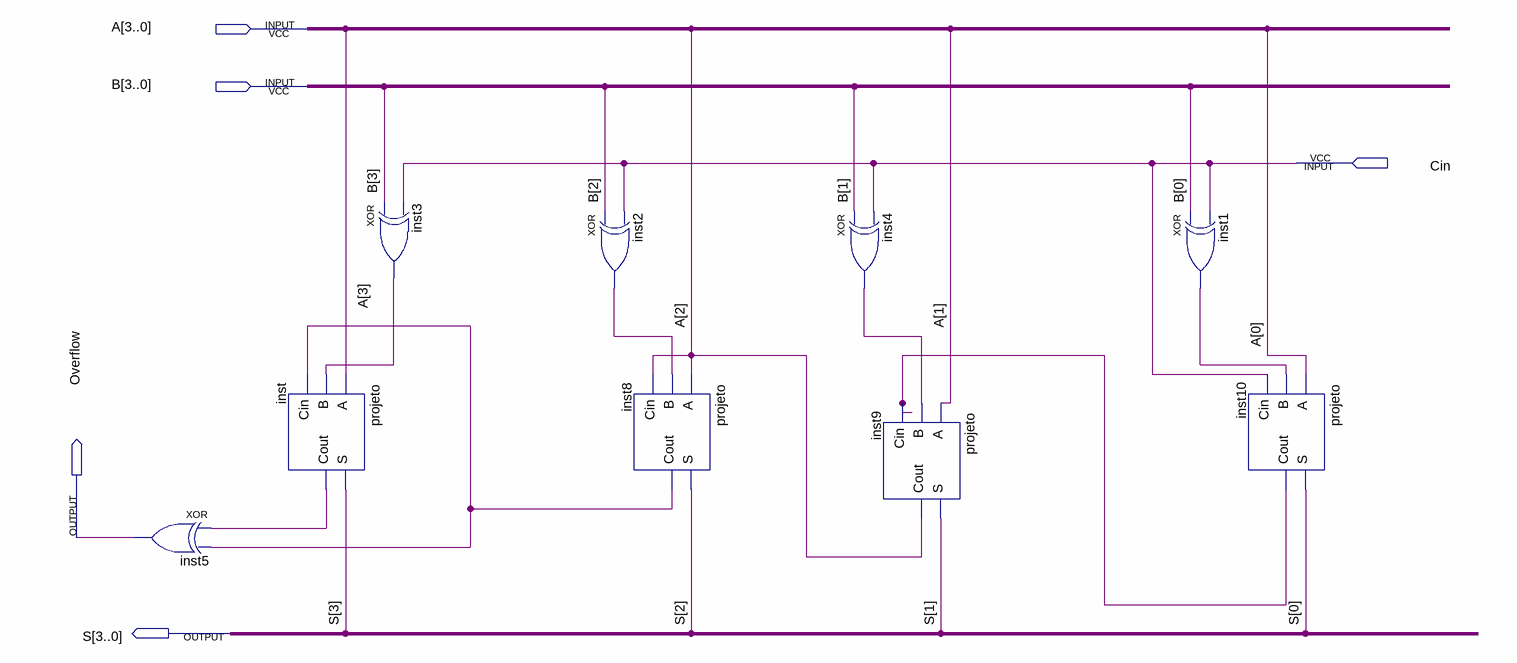
[diagram p0: schematic sheet]
// Quartus schematic Somador4Bits.bdf as structural Verilog: 9 symbols, 5 pins
module Somador4Bits (
  input  [3:0] A,
  input  [3:0] B,
  input  Cin,
  output Overflow,
  output [3:0] S
);

  wire inst1_out, inst2_out, inst3_out, inst4_out, inst8_cout, inst10_cout, inst_cout;

  xor inst5 (Overflow, inst_cout, inst8_cout);
  projeto inst (.A(A[3]), .B(inst3_out), .Cin(inst8_cout), .S(S[3]), .Cout(inst_cout));
  xor inst3 (inst3_out, B[3], Cin);
  xor inst2 (inst2_out, B[2], Cin);
  projeto inst8 (.A(A[2]), .B(inst2_out), .Cin(A[2]), .S(S[2]), .Cout(inst8_cout));
  xor inst4 (inst4_out, B[1], Cin);
  projeto inst9 (.A(A[1]), .B(inst4_out), .Cin(inst10_cout), .S(S[1]), .Cout(A[2]));
  xor inst1 (inst1_out, B[0], Cin);
  projeto inst10 (.A(A[0]), .B(inst1_out), .Cin(Cin), .S(S[0]), .Cout(inst10_cout));
endmodule
